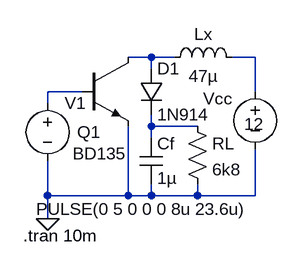
[diagram p0: schematic 12_33.asc]
12_33.asc, the LTspice schematic file:
Version 4
SHEET 1 880 680
WIRE 208 64 176 64
WIRE 240 64 208 64
WIRE 352 64 320 64
WIRE 208 80 208 64
WIRE 112 112 64 112
WIRE 352 112 352 64
WIRE 64 128 64 112
WIRE 208 160 208 144
WIRE 272 160 208 160
WIRE 208 176 208 160
WIRE 64 256 64 208
WIRE 176 256 176 160
WIRE 176 256 64 256
WIRE 208 256 208 240
WIRE 208 256 176 256
WIRE 272 256 272 240
WIRE 272 256 208 256
WIRE 352 256 352 192
WIRE 352 256 272 256
WIRE 64 288 64 256
FLAG 64 288 0
SYMBOL voltage 64 112 R0
WINDOW 3 -16 163 Left 0
WINDOW 123 0 0 Left 0
SYMATTR InstName V1
SYMATTR Value PULSE(0 5 0 0 0 8u 23.6u)
SYMATTR SpiceLine Rser=1k
SYMBOL ind 224 80 R270
WINDOW 0 32 56 VTop 0
WINDOW 3 5 56 VBottom 0
SYMATTR InstName Lx
SYMATTR Value 47µ
SYMATTR SpiceLine Ipk=1 Rser=0.0957 Rpar=4430 Cpar=0 mfg="Coilcraft" pn="DT3316P-473"
SYMBOL npn3 112 64 R0
WINDOW 0 -7 104 Left 0
WINDOW 3 -13 134 Left 0
SYMATTR InstName Q1
SYMATTR Value BD135
SYMBOL voltage 352 96 R0
WINDOW 0 -72 26 Left 0
WINDOW 3 -15 61 Left 0
WINDOW 123 0 0 Left 0
SYMATTR InstName Vcc
SYMATTR Value 12
SYMATTR SpiceLine Rser=1
SYMBOL diode 192 80 R0
SYMATTR InstName D1
SYMATTR Value 1N914
SYMBOL cap 192 176 R0
SYMATTR InstName Cf
SYMATTR Value 1µ
SYMATTR SpiceLine V=50 Irms=5.62 Rser=0.007 Lser=0 mfg="KEMET" pn="C1210C105K5PAC" type="X5R"
SYMBOL res 256 144 R0
SYMATTR InstName RL
SYMATTR Value 6k8
TEXT 30 312 Left 0 !.tran 10m

The netlist it stands for:
* 12_33.asc
V1 N003 0 PULSE(0 5 0 0 0 8u 23.6u) Rser=1k
Lx N001 N002 47µ Ipk=1 Rser=0.0957 Rpar=4430 Cpar=0 mfg="Coilcraft" pn="DT3316P-473"
Q1 N001 N003 0 0 BD135
Vcc N002 0 12 Rser=1
D1 N001 N004 1N914
Cf N004 0 1µ V=50 Irms=5.62 Rser=0.007 Lser=0 mfg="KEMET" pn="C1210C105K5PAC" type="X5R"
RL N004 0 6k8
.model D D
.lib standard.dio
.model NPN NPN
.model PNP PNP
.lib standard.bjt
.tran 10m
.backanno
.end